# Altium schematic sheet 485&232.SchDoc
size A4
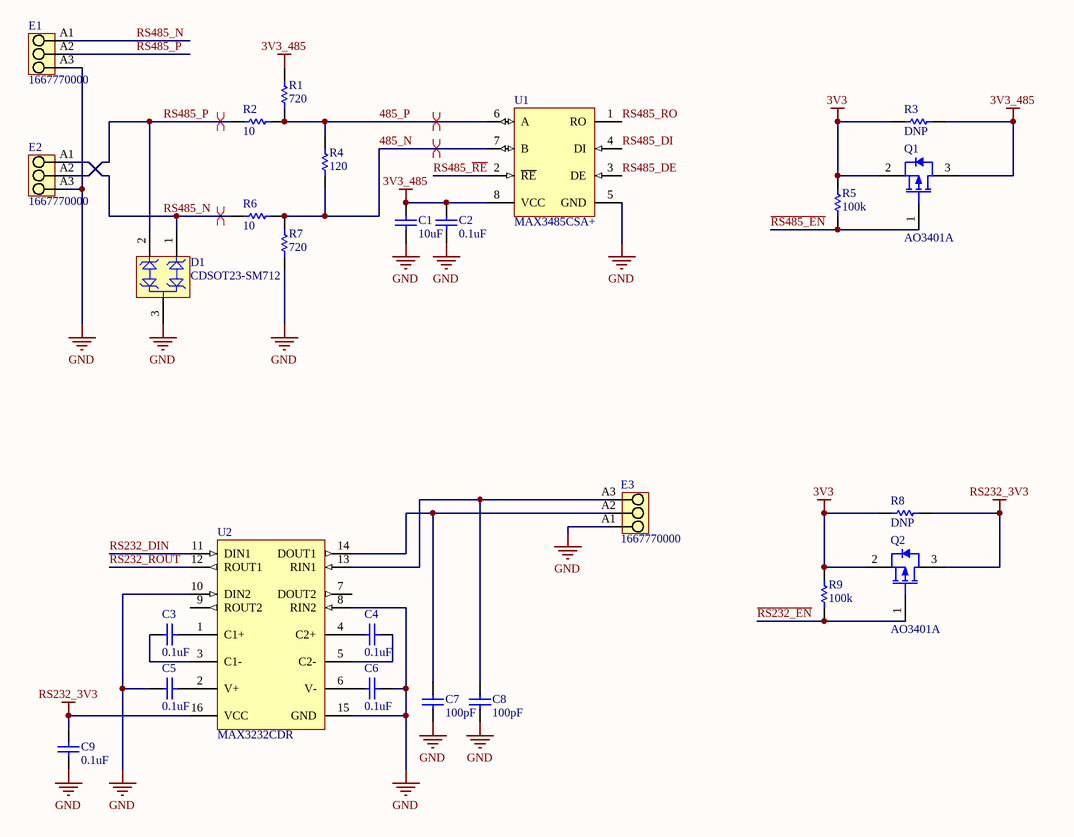
[diagram p0: 485&232.SchDoc]

## Parts
C1  10uF  [CAPC0805(2012)145_L]
C2  0.1uF  [CAPC0603(1608)100_L]
C3  0.1uF  [CAPC0603(1608)100_L]
C4  0.1uF  [CAPC0603(1608)100_L]
C5  0.1uF  [CAPC0603(1608)100_L]
C6  0.1uF  [CAPC0603(1608)100_L]
C7  100pF  [CAPC0603(1608)100_L]
C8  100pF  [CAPC0603(1608)100_L]
C9  0.1uF  [CAPC0603(1608)100_L]
D1  CDSOT23-SM712  [BOUR-SOT23-3_V]
E1  1667770000  [LM_3_5_90_03]
E2  1667770000  [LM_3_5_90_03]
E3  1667770000  [LM_3_5_90_03]
Q1  AO3401A  [AO-SOT-23-3L_V]
Q2  AO3401A  [AO-SOT-23-3L_V]
R1  720  [RESC0603(1608)_L]
R2  10  [RESC0603(1608)_L]
R3  DNP  [RESC0603(1608)_L]
R4  120  [RESC0603(1608)_L]
R5  100k  [RESC0603(1608)_L]
R6  10  [RESC0603(1608)_L]
R7  720  [RESC0603(1608)_L]
R8  DNP  [RESC0603(1608)_L]
R9  100k  [RESC0603(1608)_L]
U1  MAX3485CSA+  [SOIC-8]
U2  MAX3232CDR  [D0016A_L]

## Nets
3V3: Q1.2(SOURCE) Q2.2(SOURCE) R3.1 R5.1 R8.1 R9.1
3V3_485: C1.2 C2.2 Q1.3(DRAIN) R1.1 R3.2 U1.8(VCC)
GND: C1.1 C2.1 C5.2 C6.2 C7.1 C8.1 C9.1 D1.3 E1.A3 E2.A3 E3.A1 R7.2 U1.5(GND) U2.8(RIN2) U2.10(DIN2) U2.15(GND)
RS232_3V3: C9.2 Q2.3(DRAIN) R8.2 U2.16(VCC)
485_N: R4.2 R6.2 R7.1 U1.7(B)
485_P: R1.2 R2.2 R4.1 U1.6(A)
~{RS232_EN}: Q2.1(GATE) R9.2
~{RS485_EN}: Q1.1(GATE) R5.2
RS232_DIN: U2.11(DIN1)
RS232_ROUT: U2.12(ROUT1)
RS485_DE: U1.3(DE)
RS485_DI: U1.4(DI)
RS485_N: D1.1 E1.A1 E2.A1 R6.1
RS485_P: D1.2 E1.A2 E2.A2 R2.1
RS485_~{RE}: U1.2(~{RE})
RS485_RO: U1.1(RO)
NetC3_1: C3.1 U2.1(C1+)
NetC3_2: C3.2 U2.3(C1-)
NetC4_1: C4.1 U2.5(C2-)
NetC4_2: C4.2 U2.4(C2+)
NetC5_1: C5.1 U2.2(V+)
NetC6_1: C6.1 U2.6(V-)
NetC7_2: C7.2 E3.A2 U2.14(DOUT1)
NetC8_2: C8.2 E3.A3 U2.13(RIN1)

Not connected (* = marked no-connect by the designer): U2 7(DOUT2) 9(ROUT2)

## Layout directives
differential pair: 485_N, 485_P, RS485_N, RS485_P

## Library data of the parts
C1 = CAP_5_1: 0805 (2012 Metric) Chip Capacitor; Case-EIA: 0805; Case-Metric: 2012; PackageReference: CAPC0805(2012)145
C2-C6 C9 = CAP_5: 0603 (1608 Metric) Chip Capacitor; Case-Metric: 1608; Case-EIA: 0603; PackageReference: CAPC0603(1608)100
C7 C8 = CMP-1590-00005-1: 0603 (1608 Metric) Chip Capacitor; Case-Metric: 1608; Case-EIA: 0603; PackageReference: CAPC0603(1608)100
D1 = CMP-2000-05081-1: Surface Mount TVS Diode, 17 A Ipp, -55 to 150 degC, 3-Pin SOT23, RoHS, Tape and Reel; Manufacturer: Bourns; Catalog Drawings: CDSOT23-SM712Schematic; Current - Peak Pulse (10/1000µs): 17A(8/20µs); Voltage - Breakdown (Min): 7.5V,13.3V; Online Catalog: CDSOT23Series; Power Line Protection: No; Bidirectional Channels: 2; Type: Zener; For Use With: EVAL-CN0313-SDPZ-ND-EVALEMCRS-485CERTIFIED; Kits: PN-DESIGNKIT-22-ND-KITESD/EFTSURGEPROTECTION; Capacitance @ Frequency: 75pF@1MHz; Product Training Modules: ESDProtectionProducts; Voltage - Clamping (Max) @ Ipp: 14V,26V; Voltage - Reverse Standoff (Typ): 7V(Max),12V(Max); Related Products: ADM3485EARZ-REEL7TR-ND-ICTXRXRS-485HS3.3V8SOICADM3485EARZ-REEL7CT-ND-ICTXRXRS-485HS3.3V8SOICADM3485EARZ-REEL7DKR-ND-ICTXRXRS-485HS3.3V8SOICADM3485EARZ-ND-ICTX/RXRS-485HS3.3V8-SOICADM3485EAR-ND-ICTX/RXRS-485HS3.3V8-SOIC296-38503-5-ND-ICTXRXRS4853.3VESD14SOIC296-38501-5-ND-ICRS485TXRX3.3ESD8SOIC296-38522-5-ND-ICTXRXRS4853.3V14SOIC296-38502-5-ND-ICTXRXRS4853.3VESD14SOICADM3485EARZ-REELTR-ND-ICTXRXRS-4853.3V8SOICADM3485EARZ-REELCT-ND-ICTXRXRS-4853.3V8SOICADM3485EARZ-REELDKR-ND-ICTXRXRS-4853.3V8SOIC296-40517-2-ND-ICTXRXRS4853.3V14SOIC296-40517-1-ND-ICTXRXRS4853.3V14SOIC296-40517-6-ND-ICTXRXRS4853.3V14SOIC296-40519-2-ND-ICRS485TXRX3.3ESD8SOIC296-40519-1-ND-ICRS485TXRX3.3ESD8SOIC296-40519-6-ND-ICRS485TXRX3.3ESD8SOIC296-40524-2-ND-ICTXRXRS4853.3VESD8SOIC296-40524-1-ND-ICTXRXRS4853.3VESD8SOIC296-40524-6-ND-ICTXRXRS4853.3VESD8SOIC296-40522-2-ND-ICTXRXRS4853.3VESD14SOIC296-40522-1-ND-ICTXRXRS4853.3VESD14SOIC296-40522-6-ND-ICTXRXRS4853.3VESD14SOIC296-40529-2-ND-ICRS485TXRX3.3ESD8SOIC296-40529-1-ND-ICRS485TXRX3.3ESD8SOIC2; Other Names: CDSOT23-SM712CT; Power - Peak Pulse: 400W; Applications: GeneralPurpose; Supplier Device Package: SOT-23-3; Package / Case: TO-236-3,SC-59,SOT-23-3; Mounting Type: SurfaceMount; Datasheet URL: https://datasheet.ciiva.com/11193/cdsot23-sm712-11193846.pdf; Standard Package: 1; Series: -; Category: CircuitProtection; Unidirectional Channels: -; Package Description: 3-Lead Small Out-Line Transistor, Body 2.9x1.3mm, Pitch 0.95mm; Family: TVS-Diodes; Datasheet Version: Aug-12; Manufacturer URL: http://www.bourns.com/; Operating Temperature: -55degC~150degC(TJ); Packaging: CutTape(CT)
E1-E3 = CMP-1559-01729-1: OMNIMATE Signal - series LM; Manufacturer: Weidmueller; Contact_material: Cu-Leg; Contact_surface: tinned; Rated_current_use_group_B_UL_1059: 10 A; Insulating_material: PA; Wire_cross_section_AWG_min_UL_1059: AWG 28; Short_text_for_material: LM 3.50/03/90 3.2SN OR BX; Solid_max_H05_07_V_U: 1,5 mm²; Rated_current_min_no_of_poles_TU_20_deg_C: 32 A; Solder_pin_length_mm: 3,2 mm; Mounting_onto_the_PCB: Solder connection; Wire_cross_section_AWG_max_UL_1059: AWG 14; No_of_poles: 3; Rated_voltage_use_group_B_UL_1059: 300 V; Side_termination_characteristic: closed side; Rated_voltage_for_surge_voltage_class_pollution_degree_II_2: 320 V; UL_94_flammability_rating: V-2; Pitch_mm: 3,5 mm; Pitch_inch: 0,138 inch; Solid_min_H05_07_V_U: 0,5 mm²; ComponentLink2URL: http://catalog.weidmueller.com/catalog/Start.do?localeId=en&ObjectID=1667770000; Revision: V1; ComponentLink2Description: URL Link1; Packaging: Box; Colour: Orange; ComponentLink1Description: Manufacturer URL; PackageReference: LM_3_5_90_03; Qty: 100 PCS; PartNumber: 1667770000; ComponentLink1URL: http://www.weidmueller.com/
Q1 Q2 = CMP-2000-05778-1: P-Channel MOSFET, 30 V, 4 A, -55 to 150 degC, 3-Pin SOT-23-3L, RoHS, Tape and Reel; Manufacturer: Alpha and Omega; Output Power (Max): NotRequiredW; Power Dissipation: 1.4W; Rad Hardened: No; Drain Efficiency: NotRequired%; Drain-Source On-Volt: 30V; Noise Figure: NotRequireddB; Frequency (Max): NotRequiredMHz; Number of  Elements: 1; Gate-Source Voltage (Max): ?12V; Drain Current (Max): 4A; Channel Mode: Enhancement; Drain-Source On-Res: 0.044ohm; Type: PowerMOSFET; Polarity: P; Package URL: http://www.aosmd.com/res/packaging_information/SOT-23-3L.pdf; Datasheet URL: http://www.aosmd.com/res/data_sheets/AO3401A.pdf; Package Type: SOT-23; Package Description: 3-Pin Small Outline Transistor, Body 2.95 x 1.6 mm, Pitch 0.95 mm; Mounting: SurfaceMount; Manufacturer URL: http://www.aosmd.com/; Continuous Drain Current: 4A; Package Reference: SOT-23-3L; Mounting Technology: SurfaceMount; Operating Temperature Classification: Military; Power Gain: NotRequireddB; Datasheet Version: Rev. 3, 03/2011; Operating Temp Range: -55Cto150C; Pin Count: 3
R1-R9 = RES_3_1: 0603 (1608 Metric) Chip Resistor; Case-Metric: 1608; Case-EIA: 0603; PackageReference: RESC0603(1608)
U1 = MAXM-MAX485CSA+-8: Low-Power, Slew-Rate-Limited RS-485/RS-422 Transceiver, 3.3 V, 0 to 70 degC, 8-Pin SOIC, RoHS, Tape and Reel; Manufacturer: Maxim; No. of Receivers: 1; Transceiver Type: Differential; Supply Voltage Min: 4.75V; IC Generic Number: 485; IC Temperature Range: Commercial; No. of Pins: 8; Supply Voltage Range: 4.75Vto5.25V; Interface: RS-422/RS-485; Supply Voltage Max: 5.25V; Data Rate: 2.5Mbps; Line / Bus Driver / Receiver / Transceiver Type: CMOSDifferential; Supply Current: 500µA; Interface Type: RS422,RS485; Device Type: Transceiver; Manufacturer URL: http://www.maximintegrated.com/; Operating Temperature Range: 0degCto+70degC; Package / Case: SOIC; Digital IC Case Style: SOIC; Operating Temperature Max: 70degC; Device Marking: MAX485CSA+; Driver Case Style: SOIC; Datasheet Version: Rev. 8, 10/2003; Operating Temperature Min: 0degC; Datasheet URL: https://datasheet.ciiva.com/29306/170071-da-01-en-ic-max485csa-so8-29306144.pdf; Base Number: 485; No. of Drivers: 1; Logic Function Number: 485
U2 = TI-MAX3232-SOIC_D-16: 3-V to 5.5-V Multichannel RS-232 Line Driver / Receiver with ±15-kV ESD Protection, 0 to 70 degC, 16-Pin SOIC (D), Green (RoHS & no Sb/Br); Receivers Per Package: 2; ESD HBM(kV): +/-15; ICC(Max)(mA): 1; Supply Voltage(s)(V): 3.3 or 5.0; Single Supply: TRUE; ComponentLink1URL: www.ti.com; ComponentLink3URL: http://www.ti.com/litv/pdf/mpds178g; PackageReference: D0016A; ComponentLink2Description: Datasheet; ComponentLink2URL: http://www.ti.com/general/docs/lit/getliterature.tsp?genericPartNumber=MAX3232&fileType=pdf; ComponentLink1Description: Manufacturer URL; PackageDescription: 16-Pin Plastic Small Outline Integrated Circuit, 9.9 x 3.9 mm, Pitch 1.27 mm Pitch; PackageVersion: revM, Jun-2011; Drivers Per Package: 2; SubFamily: RS-232; DatasheetVersion: SLLS410I; ComponentLink3Description: Package Specification; RS-232: TRUE